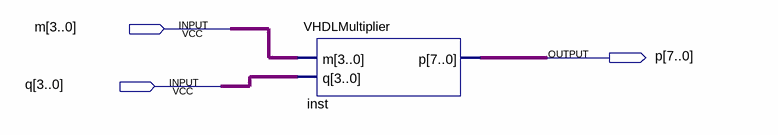
[diagram p0: schematic sheet]
// Quartus schematic SchematicVHDL.bdf as structural Verilog: 1 symbols, 3 pins
module SchematicVHDL (
  input  [3:0] m,
  input  [3:0] q,
  output [7:0] p
);

  VHDLMultiplier inst (.m(m), .q(q), .p(p));
endmodule
